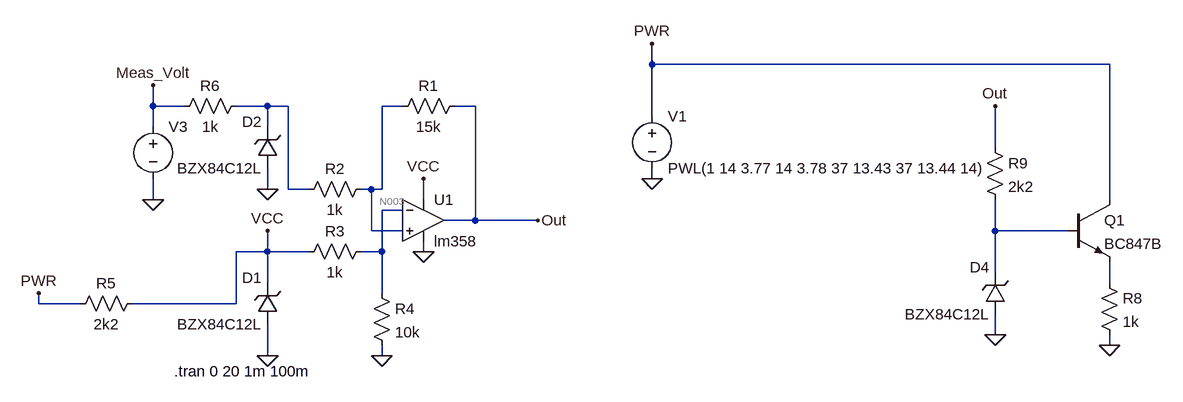
[diagram p0: schematic LM358_Cmp.asc]
* LM358_Cmp.asc
R1 Out N002 15k tol=5%
R2 N002 N001 1k tol=5%
R3 N003 VCC 1k tol=5%
R4 N003 0 10k tol=5%
V1 PWR 0 PWL(1 14 3.77 14 3.78 37 13.43 37 13.44 14)
V3 Meas_Volt 0 PWL(1 5 2 7 3 9 4 12 5 14 6 17 7 15 8 13 9 12 10 11 11 10 12 7 13 5 14 4)
D1 0 VCC BZX84C12L
R5 VCC PWR 2k2 tol=5%
D2 0 N001 BZX84C12L
R6 N001 Meas_Volt 1k tol=5%
Q1 PWR N004 N005 0 BC847B
R8 N005 0 1k tol=5%
D4 0 N004 BZX84C12L
R9 Out N004 2k2 tol=5%
* U1: lm358 (symbol myLib\lm358 not available, pins judged from their places): In+=N002 In-=N003 V+=VCC V-=0 OUT=Out
.model D D
.lib standard.dio
.model NPN NPN
.model PNP PNP
.lib standard.bjt
.tran 0 20 1m 100m
.backanno
.end

* Results of the author's LTspice run, read from the files saved beside the schematic
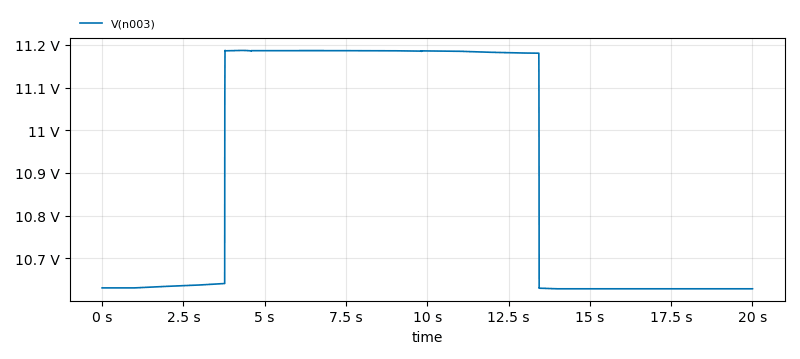
[diagram p1: Transient Analysis of LM358_Cmp.asc, plotted from the saved traces]
* Transient Analysis, 1 run:
*   V(n003): min 10.63 V, max 11.19 V, average 10.9 V, rms 10.9 V, last 10.63 V